# EAGLE schematic Schematic (EAGLE 9.6.2)
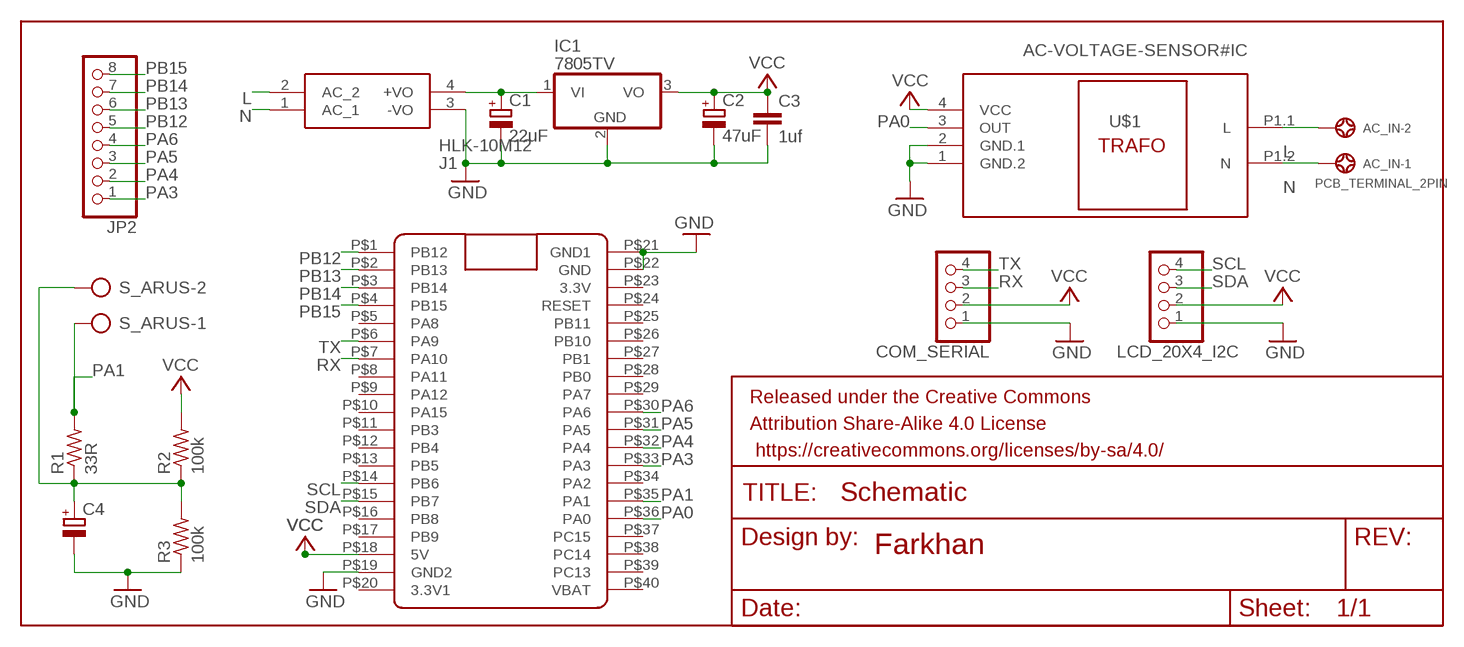
[diagram p0: schematic, sheet 1]

## Parts
AC_IN  PCB_TERMINAL_2PIN  [PCB_TERMINAL_2PIN]
C1  22uF  CPOL-EUE2.5-7  [E2,5-7]
C2  47uF  CPOL-EUE2.5-7  [E2,5-7]
C3  1uf  C-EU050-025X075  [C050-025X075]
C4  CPOL-EUE2.5-6  [E2,5-6]
COM_SERIAL  PINHD-1X4  [1X04]
FRAME1  FRAME-LEDGER  [CREATIVE_COMMONS]
IC1  7805TV  [TO220V]
J1  HLK-10M12  [HLK10M12]
JP2  PINHD-1X8  [1X08]
LCD_20X4_I2C  PINHD-1X4  [1X04]
R1  33R  R-US_0207/10  [0207/10]
R2  100k  R-US_0207/10  [0207/10]
R3  100k  R-US_0207/10  [0207/10]
S_ARUS  AK500/2  [AK500/2]
U$1  AC-VOLTAGE-SENSOR#IC  [AC-VOLTAGE-SENSOR#IC]
U$2  BLUE_PILL  [BLUE_PILL]

## Nets
GND: C1.- C2.- C3.2 C4.- COM_SERIAL.1 IC1.2(GND) J1.3(-VO) LCD_20X4_I2C.1 R3.1 U$1.1(GND.2) U$1.2(GND.1) U$2.P$19(GND2) U$2.P$21(GND1) U$2.P$22(GND)
L: AC_IN.2 J1.2(AC_2) U$1.P1.1(L)
N: AC_IN.1 J1.1(AC_1) U$1.P1.2(N)
N$1: C1.+ IC1.1(VI) J1.4(+VO)
N$3: C4.+ R1.1 R2.1 R3.2 S_ARUS.2
PA0: U$1.3(OUT) U$2.P$36(PA0)
PA1: R1.2 S_ARUS.1 U$2.P$35(PA1)
PA3: JP2.1 U$2.P$33(PA3)
PA4: JP2.2 U$2.P$32(PA4)
PA5: JP2.3 U$2.P$31(PA5)
PA6: JP2.4 U$2.P$30(PA6)
PB12: JP2.5 U$2.P$1(PB12)
PB13: JP2.6 U$2.P$2(PB13)
PB14: JP2.7 U$2.P$3(PB14)
PB15: JP2.8 U$2.P$4(PB15)
RX: COM_SERIAL.3 U$2.P$7(PA10)
SCL: LCD_20X4_I2C.4 U$2.P$14(PB6)
SDA: LCD_20X4_I2C.3 U$2.P$15(PB7)
TX: COM_SERIAL.4 U$2.P$6(PA9)
VCC: C2.+ C3.1 COM_SERIAL.2 IC1.3(VO) LCD_20X4_I2C.2 R2.2 U$1.4(VCC) U$2.P$18(5V)
Unconnected: U$2.P$5(PA8) U$2.P$8(PA11) U$2.P$9(PA12) U$2.P$10(PA15) U$2.P$11(PB3) U$2.P$12(PB4) U$2.P$13(PB5) U$2.P$16(PB8) U$2.P$17(PB9) U$2.P$20(3.3V1) U$2.P$23(3.3V) U$2.P$24(RESET) U$2.P$25(PB11) U$2.P$26(PB10) U$2.P$27(PB1) U$2.P$28(PB0) U$2.P$29(PA7) U$2.P$34(PA2) U$2.P$37(PC15) U$2.P$38(PC14) U$2.P$39(PC13) U$2.P$40(VBAT)

## Notes on the sheet
- Farkhan

## Library data of the parts
AC_IN = PCB_Terminal:PCB_TERMINAL_2PIN
C1 C2 C4 = rcl:CPOL-EU: POLARIZED CAPACITOR, European symbol; SPICEPREFIX: C
C3 = rcl:C-EU: CAPACITOR, European symbol; SPICEPREFIX: C
COM_SERIAL LCD_20X4_I2C = pinheadkecil:PINHD-1X4: PIN HEADER
FRAME1 = SparkFun-Aesthetics:FRAME-LEDGER: Schematic Frame - Ledger Standard 11x14 US Ledger frame
IC1 = linear:78*: Positive VOLTAGE REGULATOR Source: http://cache.national.com/ds/LM/LM78L05.pdf http://www.fairchildsemi.com/ds/LM/LM7805.pdf
J1 = HLK-10M12:HLK-10M12: connector Source: Datasheet <https://datasheet.lcsc.com/szlcsc/1909111105_HI-LINK-HLK-10M12_C403746.pdf>; DESCRIPTION: connector; HEIGHT: 21.8mm; MANUFACTURER_NAME: Hi-Link; MANUFACTURER_PART_NUMBER: HLK-10M12
JP2 = pinheadkecil:PINHD-1X8: PIN HEADER
R1-R3 = rcl:R-US_: RESISTOR, American symbol; SPICEPREFIX: R
S_ARUS = con-ptr500:AK500/2: CONNECTOR; OC_FARNELL: unknown; OC_NEWARK: unknown
U$1 = diy-modules:AC-VOLTAGE-SENSOR#IC: Isolated AC Voltage Sensor based on ZMPT101B transformer Symbol with input connector ZMPT101B Voltage Transformer Operating Guide is available here: http://www.zeming-e.com/file/0_2013_10_18_093344.pdf Click here to find device on ebay.com <http://www.ebay.com/sch/arduino+voltage+transformer>
U$2 = BluePill:BLUE_PILL